# EAGLE design cv_switch (EAGLE 6.3)
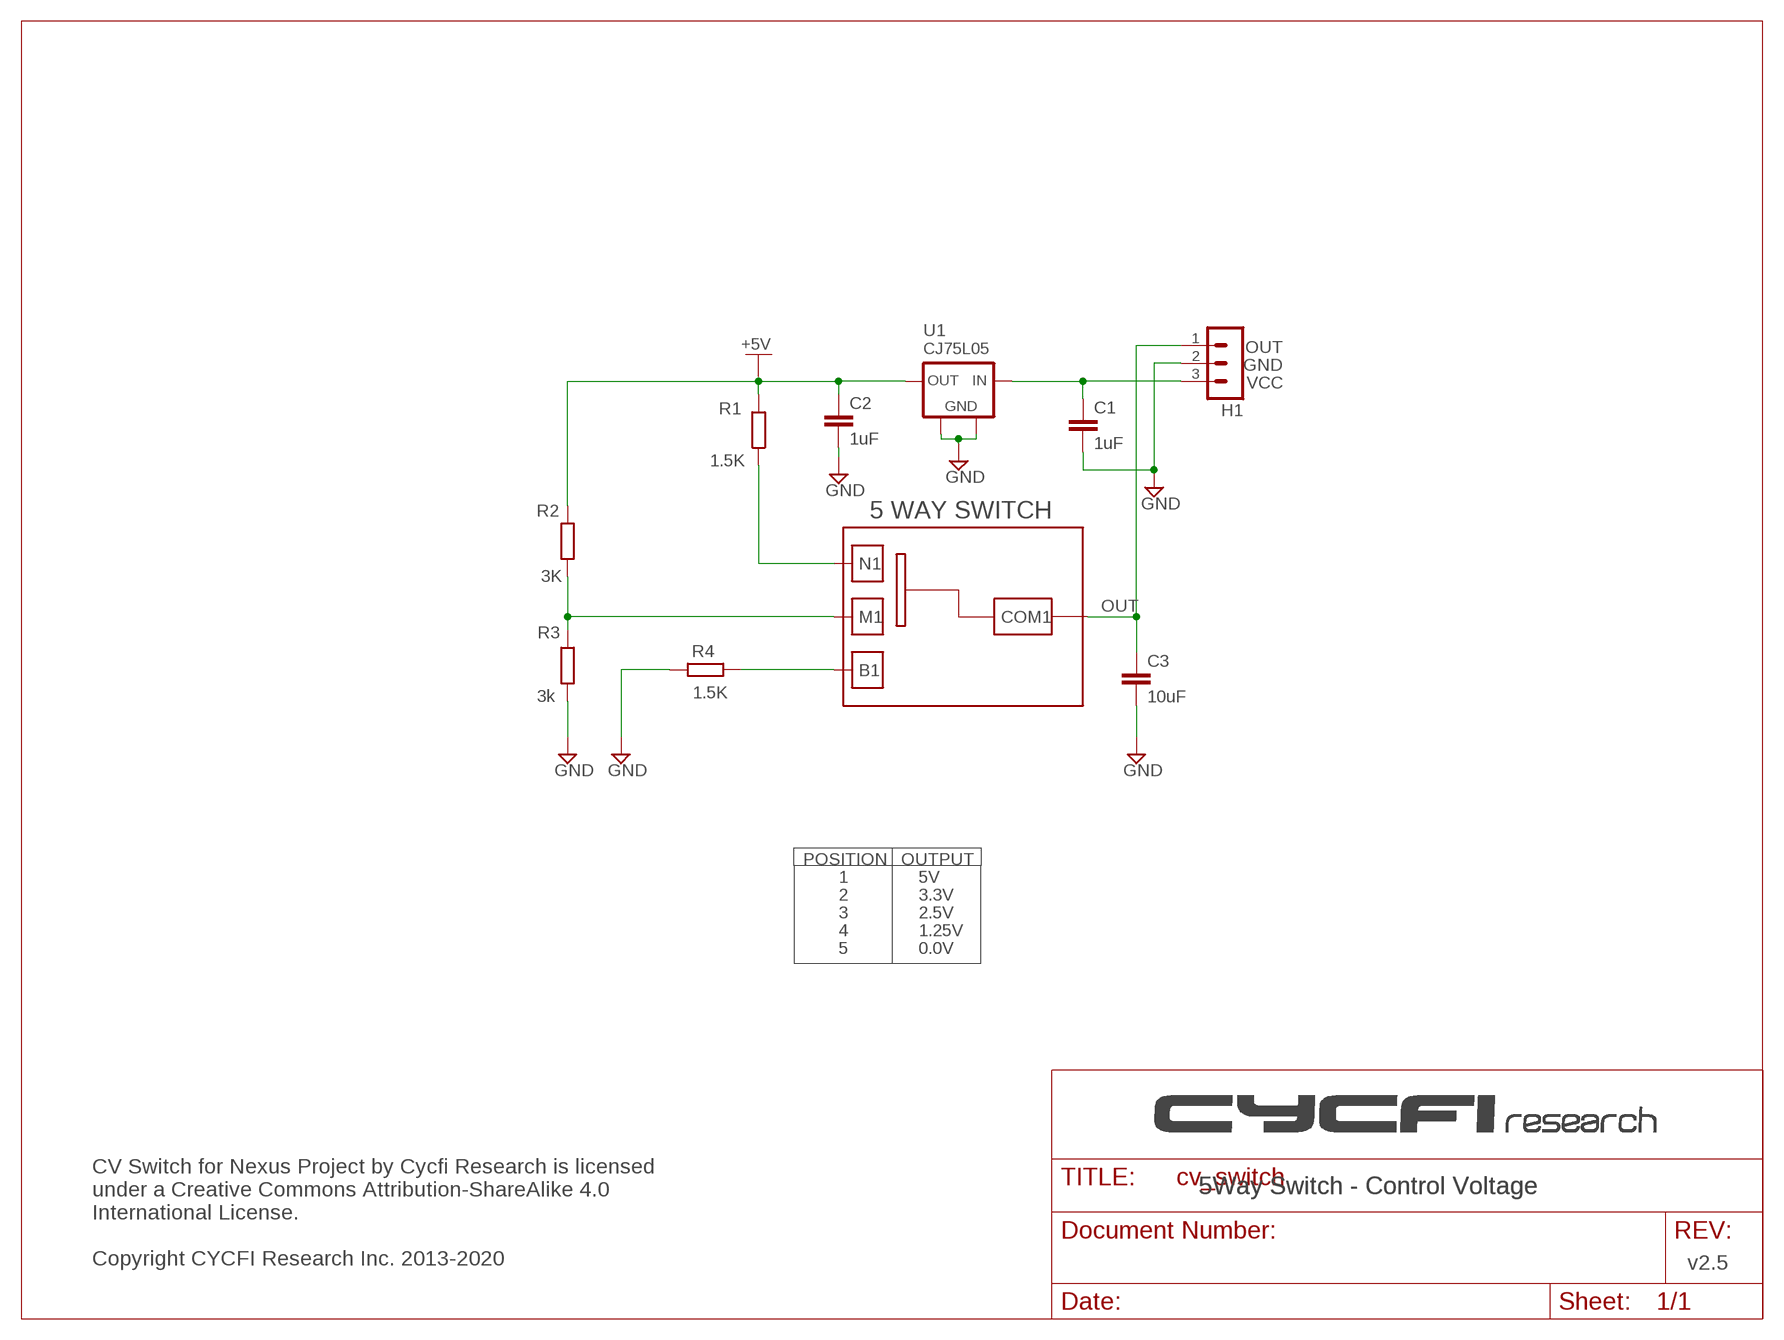
[diagram p0: schematic, sheet 1]

## Parts
C1  1uF  C-EUC0603  [C0603]
C2  1uF  C-EUC0603  [C0603]
C3  10uF  C-EUC0603  [C0603]
H1  MA03-1_EDITED  [MA03-1_]
R1  1.5K  R-EU_R0402  [R0402]
R2  3K  R-EU_R0402  [R0402]
R3  3k  R-EU_R0402  [R0402]
R4  1.5K  R-EU_R0402  [R0402]
U1  CJ75L05  L78LXX  [SOT89]
U$1  5WAY_SW_1  [5WAY_SW_CASTELLATED]

## Nets
+5V: C2.1 R1.2 R2.2 U1.1(IN)
GND: C1.2 C2.2 C3.2 H1.2 R3.1 R4.1 U1.2(GND) U1.2@1(GND1)
N$1: C1.1 H1.3 U1.3(OUT)
N$3: R4.2 U$1.B1
N$6: R2.1 R3.2 U$1.M1
N$7: R1.1 U$1.N1
OUT: C3.1 H1.1 U$1.COM1

## Notes on the sheet
- OUT
- CJ75L05 | GND
- VCC
- POSITION | OUTPUT
- 1 | 5V
- 2 | 3.3V
- 3 | 2.5V
- 4 | 1.25V
- 5 | 0.0V
- 5Way Switch - Control Voltage | 5Way Switch - Control Voltage
- CV Switch for Nexus Project by Cycfi Research is licensed 
  under a Creative Commons Attribution-ShareAlike 4.0 
  International License. 
  
  Copyright CYCFI Research Inc. 2013-2020
- v2.5

## Library data of the parts
C1-C3 = resistor:C-EU: CAPACITOR, European symbol
H1 = con-lstb:MA03-1: PIN HEADER
R1-R4 = resistor:R-EU_: RESISTOR, European symbol
U1 = CYCFI_Power:L78LXX
U$1 = CYCFI_switch:5WAY_SW_1

## Board
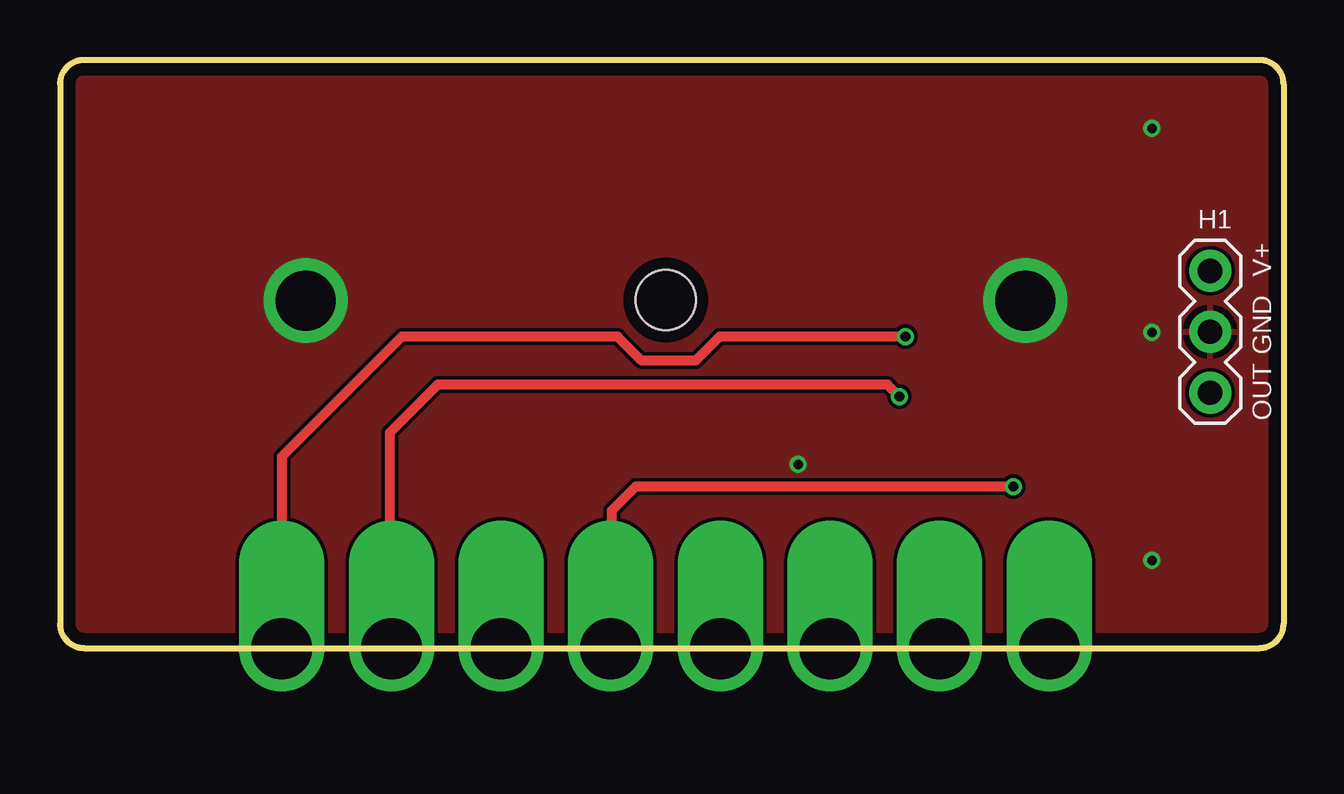
[diagram p1: board, top side]
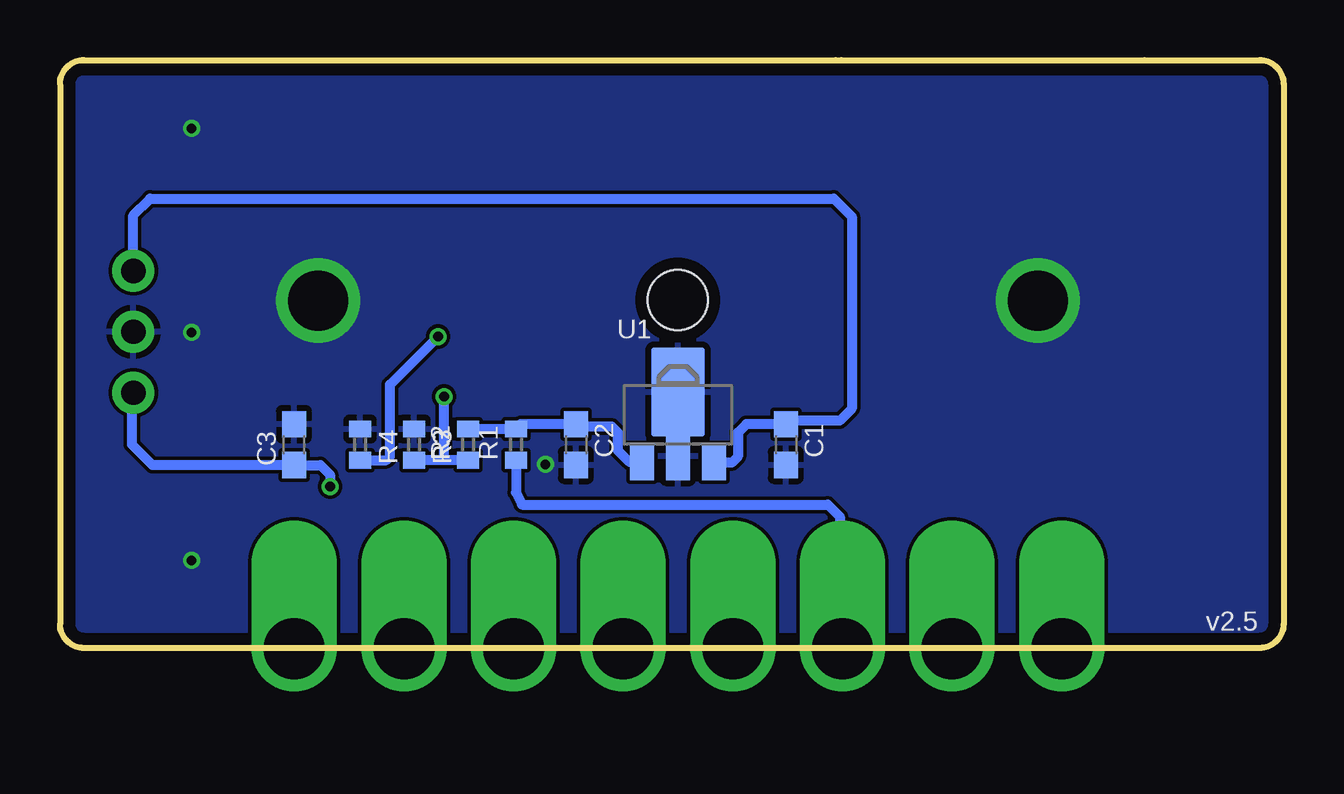
[diagram p2: board, bottom side, seen from below]

Size 51 x 24.5 mm. Coordinates in mm from the lower left corner, seen from the top.
Outline: 18.67,24.5 5.8,24.5
Outline: 44.8,24.5 31.93,24.5
Outline: 18.44,24.5 50,24.5 arc-90 51,23.5 51,1 arc-90 50,0 1,0 arc-90 0,1 0,23.5 arc-90 1,24.5 5.8,24.5
Copper layers (1*16): Top 0.035mm / dielectric 1.6mm / Bottom 0.035mm
Design rules "Elecrow_2-layer_PCB_eagle_rule": minimum track width 6mil, minimum drill 12mil, track to track 6mil, track to pad 8mil, pad to pad 12mil, via to via 12mil, smd to smd 0mil, copper to edge 20mil, drill to drill 10mil, minimum pad ring 6mil, minimum via ring 6mil, stop-mask expansion 0mil, vias tented up to drill 100mil, thermal gap 10mil
Holes 2.5 mm at 25.25,14.5

### Footprints (pad centres in the part's own frame; a part is rotated, then mirrored left to right if it is on the bottom)
C0603 = smd 1.1 x 1: 1 -0.85,0; 2 0.85,0
MA03-1_ = drill 1.016 pad 1.75: 1 -2.54,0; 2 0,0; 3 2.54,0
R0402 = smd 0.7 x 0.9: 1 -0.65,0; 2 0.65,0
SOT89 = smd 1 x 1.5: 1 -1.499,-1.981; 3 1.499,-1.981 | smd 1 x 2: 2 0,-1.727 | smd 2.2 x 3.7: 2@1 0,0.94
5WAY_SW_CASTELLATED = drill 2.54 offset: B1 -15.995,0; B2 6.855,0; COM1 -2.285,0; COM2 2.285,0; M1 -11.425,0; M2 11.425,0; N1 -6.855,0; N2 15.995,0

### Placement (x,y rotation side)
C1  20.74,8.47 270 bottom
C2  29.49,8.47 270 bottom
C3  41.24,8.47 90 bottom
H1  47.94,13.17 90 top
R1  31.99,8.47 90 bottom
R2  33.99,8.47 90 bottom
R3  2K  [R0402]  36.24,8.47 270 bottom
R4  38.49,8.47 270 bottom
U1  25.24,9.72 0 bottom
U$1  25.24,-0.03 0 top

### Tracks (layer width: path | path; a pad name or v marks a point on that pad's centre or on a via)
+5V
  Bottom 0.406: U1.1 27.26,7.74 27.74,8.22 27.74,8.97 27.99,9.22 29.39,9.22 C2.1 31.79,9.32 R1.2 R2.2
GND  (via drill 0.4, 2.5)
  other vias: 10.24,14.47 40.24,14.47 30.76,7.65 45.52,13.15 45.52,3.65 45.52,21.65
  pour Top: -0.01,-0.03 50.99,-0.03 50.99,24.98 -0.01,24.98
  pour Bottom: -0.01,-0.03 50.99,-0.03 50.99,24.98 -0.01,24.98
N$1
  Bottom 0.406: H1.3 47.94,18.03 47.24,18.73 18.74,18.73 17.99,17.98 17.99,9.97 18.49,9.47 20.59,9.47 C1.1 22.39,9.32 22.74,8.97 22.74,7.97 22.99,7.72 23.72,7.72 U1.3
N$3  (via drill 0.4)
  Top 0.406: v35.24,12.97 27.49,12.97 26.49,11.97 24.24,11.97 23.24,12.97 14.24,12.97 9.24,7.97 U$1.B1
  Bottom 0.406: R4.2 37.39,7.82 37.24,7.97 37.24,10.97 v35.24,12.97
N$6  (via drill 0.4)
  Top 0.406: v34.99,10.47 34.49,10.97 15.74,10.97 13.74,8.97 13.74,0.05 U$1.M1
  Bottom 0.406: R3.2 R2.1 34.84,7.82 34.99,7.97 v34.99,10.47
N$7
  Bottom 0.406: R1.1 31.99,6.47 31.74,5.97 18.99,5.97 18.49,5.47 18.49,0.08 U$1.N1
OUT  (via drill 0.4)
  Top 0.406: v39.74,6.72 23.99,6.72 22.99,5.72 22.99,0.01 U$1.COM1
  Bottom 0.406: H1.1 47.99,10.58 47.99,8.47 47.14,7.62 C3.1 40.14,7.62 39.74,7.22 v39.74,6.72

### Text on the board
tNames: V+ | GND | OUT
bNames: v2.5